# EasyEDA schematic ENEL400 Project_2021-03-30.json
TITLE: Sheet_1; REV: 1.0; Date: 2020-01-21; Sheet: 1/1; Drawn By: Fadi Katto; Company: Your Company
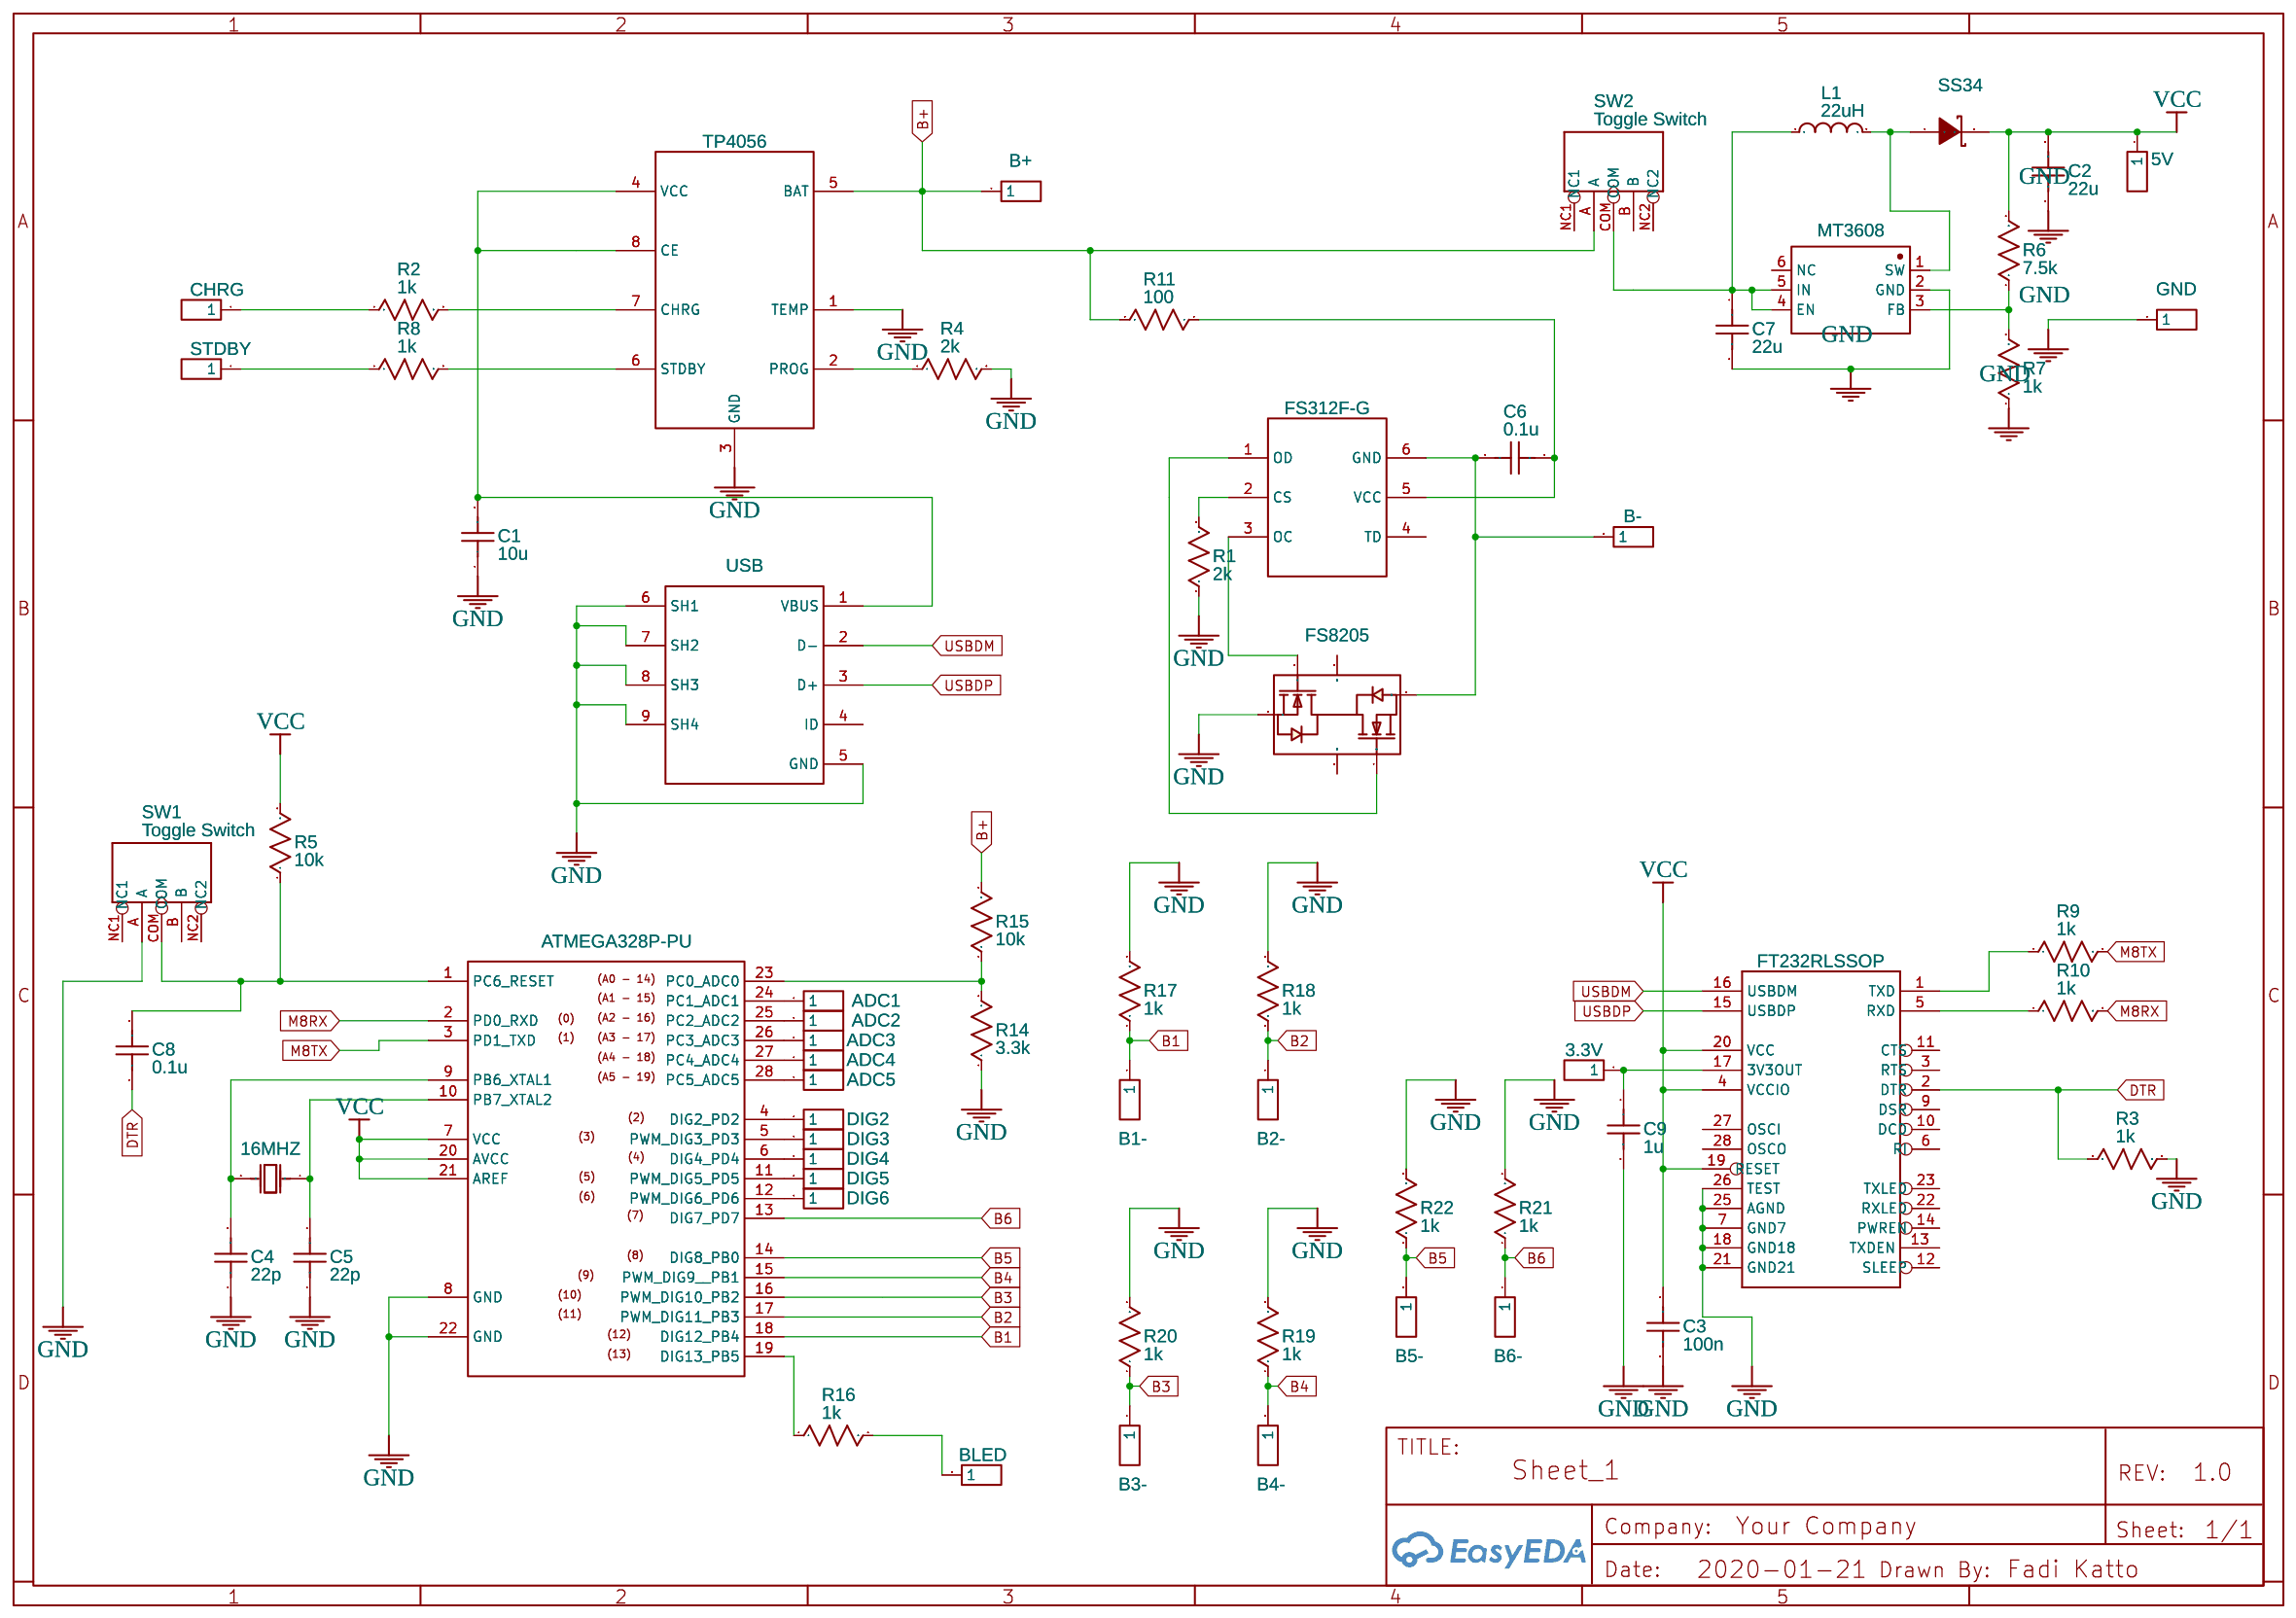
[diagram p0: schematic sheet]

## Parts
3.3V  Header-Male-2.54_1x1  [HDR-1X1/2.54]
5V  Header-Male-2.54_1x1  [HDR-1X1/2.54]
16MHZ  16MHZ  [OSC-49S-1]
ADC1  Header-Male-2.54_1x1  [HDR-1X1/2.54]
ADC2  Header-Male-2.54_1x1  [HDR-1X1/2.54]
ADC3  Header-Male-2.54_1x1  [HDR-1X1/2.54]
ADC4  Header-Male-2.54_1x1  [HDR-1X1/2.54]
ADC5  Header-Male-2.54_1x1  [HDR-1X1/2.54]
ATMEGA328P-PU  ATMEGA328P-PU  [DIP-28_300MIL]
B1-  Header-Male-2.54_1x1  [HDR-1X1/2.54]
B2-  Header-Male-2.54_1x1  [HDR-1X1/2.54]
B3-  Header-Male-2.54_1x1  [HDR-1X1/2.54]
B4-  Header-Male-2.54_1x1  [HDR-1X1/2.54]
B5-  Header-Male-2.54_1x1  [HDR-1X1/2.54]
B6-  Header-Male-2.54_1x1  [HDR-1X1/2.54]
B+  Header-Male-2.54_1x1  [HDR-1X1/2.54]
B-  Header-Male-2.54_1x1  [HDR-1X1/2.54]
BLED  Header-Male-2.54_1x1  [HDR-1X1/2.54]
C1  10u  [0805]
C2  22u  [0805]
C3  100n  [0805]
C4  22p  [0805]
C5  22p  [0805]
C6  0.1u  [0805]
C7  22u  [0805]
C8  0.1u  [0805]
C9  1u  [0805]
CHRG  Header-Male-2.54_1x1  [HDR-1X1/2.54]
DIG2  Header-Male-2.54_1x1  [HDR-1X1/2.54]
DIG3  Header-Male-2.54_1x1  [HDR-1X1/2.54]
DIG4  Header-Male-2.54_1x1  [HDR-1X1/2.54]
DIG5  Header-Male-2.54_1x1  [HDR-1X1/2.54]
DIG6  Header-Male-2.54_1x1  [HDR-1X1/2.54]
FS312F-G  FS312F-G  [SOT-23-6]
FS8205  FS8205  [SOT-23-6]
FT232RLSSOP  FT232RLSSOP  [SSOP28DB]
GND  Header-Male-2.54_1x1  [HDR-1X1/2.54]
L1  22uH  [0805]
MT3608  MT3608  [SOT-23-6]
R1  2k  [0805]
R2  1k  [0805]
R3  1k  [0805]
R4  2k  [0805]
R5  10k  [0805]
R6  7.5k  [0805]
R7  1k  [0805]
R8  1k  [0805]
R9  1k  [0805]
R10  1k  [0805]
R11  100  [0805]
R14  3.3k  [0805]
R15  10k  [0805]
R16  1k  [0805]
R17  1k  [0805]
R18  1k  [0805]
R19  1k  [0805]
R20  1k  [0805]
R21  1k  [0805]
R22  1k  [0805]
SS34  SS34  [SMA(DO-214AC)]
STDBY  Header-Male-2.54_1x1  [HDR-1X1/2.54]
SW1  Toggle Switch  [SW5-2.0-8.8X4.4X4.7MM-90D]
SW2  Toggle Switch  [SW5-2.0-8.8X4.4X4.7MM-90D]
TP4056  TP4056  [SOP-8_EP_150MIL]
USB  USB - Mini USB  [MINI USB]

## Library data of the parts
3.3V 5V ADC1-ADC5 B1- B2- B3- B4- B5- B6- B+ B- BLED CHRG DIG2-DIG6 GND STDBY = Header-Male-2.54_1x1: Supplier: LCSC; Manufacturer: ReliaPro; Supplier Part: C81276
16MHZ = 16MHZ: EasyEDA: C16212; Supplier Part: C16212; Supplier: EasyEDA; Manufacturer: EasyEDA; Manufacturer Part: X49SD16MSD2SC
ATMEGA328P-PU = ATMEGA328P-PU: sourceId: Oic6oiASL; Supplier: LCSC; Manufacturer: ATMEL; image: //image.lceda.cn/szlcsc/C33901.jpg; Contributor: Padre Maronno (Ciuliene); Supplier Part: C33901
C1-C9 = Cap_0805_US
FS312F-G = -: Supplier: LCSC; Manufacturer: FORTUNE; Manufacturer Part: DW01+G; Supplier Part: C14213
FS8205 = -: Supplier: LCSC; Manufacturer: FORTUNE; Supplier Part: C32254
FT232RLSSOP = FT232RLSSOP: USB UART; Contributor: SparkFun
L1 = Inductor_0805_US
MT3608 = -: Supplier: LCSC; Manufacturer: LCSC; Supplier Part: C84817
R1-R11 R14-R22 = Res_0805(1/8W)_US
SS34 = -: Supplier: LCSC; Supplier Part: C8678
SW1 SW2 = -: DIP Toggle Switch ON-ON; 0.3A- AC 500V; catid: 20; Manufacturer Part: 3P-2.0-90D-REINFORCE;
TP4056 = -: Contributor: Guest; Supplier: LCSC; Manufacturer: TOPPOWER; Supplier Part: C16581
USB = USB - Mini USB: link: https://www.es.co.th/Schemetic/PDF/MUMRB05FTKN.PDF; Contributor: suwanp

## Nets
GND: ATMEGA328P-PU.8(GND) ATMEGA328P-PU.22(GND) C1.1 C2.1 C3.2 C4.1 C5.1 C7.2 C9.2 FS8205.1(S1) FT232RLSSOP.7(GND7) FT232RLSSOP.18(GND18) FT232RLSSOP.21(GND21) FT232RLSSOP.25(AGND) FT232RLSSOP.26(TEST) GND.1 MT3608.2(GND) R1.1 R3.2 R4.2 R7.1 R14.1 R17.2 R18.2 R19.2 R20.2 R21.2 R22.2 SW1.A TP4056.1(TEMP) TP4056.3(GND) USB.5(GND) USB.6(SH1) USB.7(SH2) USB.8(SH3) USB.9(SH4)
VCC: 5V.1 ATMEGA328P-PU.7(VCC) ATMEGA328P-PU.20(AVCC) ATMEGA328P-PU.21(AREF) C2.2 C3.1 FT232RLSSOP.4(VCCIO) FT232RLSSOP.19(RESET) FT232RLSSOP.20(VCC) R5.2 R6.2 SS34.2(K)
B1: ATMEGA328P-PU.18(DIG12 PB4) B1-.1 R17.1
B2: ATMEGA328P-PU.17(PWM DIG11 PB3) B2-.1 R18.1
B3: ATMEGA328P-PU.16(PWM DIG10 PB2) B3-.1 R20.1
B4: ATMEGA328P-PU.15(PWM DIG9  PB1) B4-.1 R19.1
B5: ATMEGA328P-PU.14(DIG8 PB0) B5-.1 R22.1
B6: ATMEGA328P-PU.13(DIG7 PD7) B6-.1 R21.1
B+: B+.1 R11.2 R15.2 SW2.A TP4056.5(BAT)
DTR: C8.1 FT232RLSSOP.2(DTR) R3.1
M8RX: ATMEGA328P-PU.2(PD0 RXD) R10.2
M8TX: ATMEGA328P-PU.3(PD1 TXD) R9.2
USBDM: FT232RLSSOP.16(USBDM) USB.2(D-)
USBDP: FT232RLSSOP.15(USBDP) USB.3(D+)
Net-(3.3V-1): 3.3V.1 C9.1 FT232RLSSOP.17(3V3OUT)
Net-(16MHZ-1): 16MHZ.1(OSC1) ATMEGA328P-PU.10(PB7 XTAL2) C5.2
Net-(16MHZ-2): 16MHZ.2(OSC2) ATMEGA328P-PU.9(PB6 XTAL1) C4.2
Net-(ADC1-1): ADC1.1 ATMEGA328P-PU.24(PC1 ADC1)
Net-(ADC2-1): ADC2.1 ATMEGA328P-PU.25(PC2 ADC2)
Net-(ADC3-1): ADC3.1 ATMEGA328P-PU.26(PC3 ADC3)
Net-(ADC4-1): ADC4.1 ATMEGA328P-PU.27(PC4 ADC4)
Net-(ADC5-1): ADC5.1 ATMEGA328P-PU.28(PC5 ADC5)
Net-(ATMEGA328P-PU-1): ATMEGA328P-PU.1(PC6 RESET) C8.2 R5.1 SW1.COM
Net-(ATMEGA328P-PU-4): ATMEGA328P-PU.4(DIG2 PD2) DIG2.1
Net-(ATMEGA328P-PU-5): ATMEGA328P-PU.5(PWM DIG3 PD3) DIG3.1
Net-(ATMEGA328P-PU-6): ATMEGA328P-PU.6(DIG4 PD4) DIG4.1
Net-(ATMEGA328P-PU-11): ATMEGA328P-PU.11(PWM DIG5 PD5) DIG5.1
Net-(ATMEGA328P-PU-12): ATMEGA328P-PU.12(PWM DIG6 PD6) DIG6.1
Net-(ATMEGA328P-PU-19): ATMEGA328P-PU.19(DIG13 PB5) R16.1
Net-(ATMEGA328P-PU-23): ATMEGA328P-PU.23(PC0 ADC0) R14.2 R15.1
Net-(B--1): B-.1 C6.2 FS312F-G.6(GND) FS8205.3(S2)
Net-(BLED-1): BLED.1 R16.2
Net-(C1-2): C1.2 TP4056.4(VCC) TP4056.8(CE) USB.1(VBUS)
Net-(C6-1): C6.1 FS312F-G.5(VCC) R11.1
Net-(C7-1): C7.1 L1.1 MT3608.4(EN) MT3608.5(IN) SW2.COM
Net-(CHRG-1): CHRG.1 R2.1
Net-(FS312F-G-1): FS312F-G.1(OD) FS8205.4(G2)
Net-(FS312F-G-2): FS312F-G.2(CS) R1.2
Net-(FS312F-G-3): FS312F-G.3(OC) FS8205.6(G1)
Net-(FT232RLSSOP-1): FT232RLSSOP.1(TXD) R9.1
Net-(FT232RLSSOP-5): FT232RLSSOP.5(RXD) R10.1
Net-(L1-2): L1.2 MT3608.1(SW) SS34.1(A)
Net-(MT3608-3): MT3608.3(FB) R6.1 R7.2
Net-(R2-2): R2.2 TP4056.7(CHRG)
Net-(R4-1): R4.1 TP4056.2(PROG)
Net-(R8-1): R8.1 STDBY.1
Net-(R8-2): R8.2 TP4056.6(STDBY)

Not connected (* = marked no-connect by the designer): FS312F-G 4(TD); FS8205 2(D12) 5(D12); FT232RLSSOP 3(RTS) 6(RI) 9(DSR) 10(DCD) 11(CTS) 12(SLEEP) 13(TXDEN) 14(PWREN) 22(RXLED) 23(TXLED) 27(OSCI) 28(OSCO); MT3608 6(NC); SW1 B NC1 NC2; SW2 B NC1 NC2; USB 4(ID)
